# Altium schematic sheet Power_Left.SchDoc
size A4; SheetNumber: 3; SheetTotal: 3
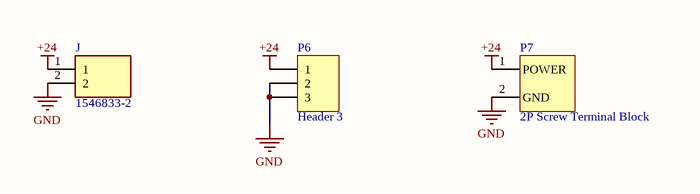
[diagram p0: Power_Left.SchDoc]

## Parts
J  1546833-2  [TE_1546833-2]
P6  Header 3  [HDR1X3]
P7  2P Screw Terminal Block  [P_Terminal block 3.5mm-pitch]

## Nets
+24: J.1 P6.1 P7.1(POWER)
GND: J.2 P6.2 P6.3 P7.2(GND)

## Library data of the parts
J = 1546833-2: 2 Circuit 0.375 (9.53mm) Barrier Block Connector, Screws with Captive Plate; MF: TE Connectivity; Availability: Warning; Price: None; Mouser-Purchase-URL: https://snapeda.com/shop?store=Mouser&id=2375941; MP: 1546833-2; Package: None; DigiKey-Purchase-URL: https://snapeda.com/shop?store=DigiKey&id=2375941; SnapEDA_Link: https://www.snapeda.com/parts/1546833-2/TE%20Connectivity%20AMP%20Connectors/view-part/2375941/?ref=snap; Value: *
P6 = Header 3: Header, 3-Pin; LatestRevisionDate: 17-Jul-2002; LatestRevisionNote: Re-released for DXP Platform.; Publisher: Altium Limited
P7 = P_Terminal block: Green Straight pin 3.5mm  pitch; P=3.5mm  Screw terminal ROHS; MFR Part #: KF350-3.5-2P; Manufacturer: Cixi Kefa Elec; LCSC Part#: C474892; DataSheet: https://datasheet.lcsc.com/lcsc/2001160007_Cixi-Kefa-Elec-KF350-3-5-2P_C474892.pdf